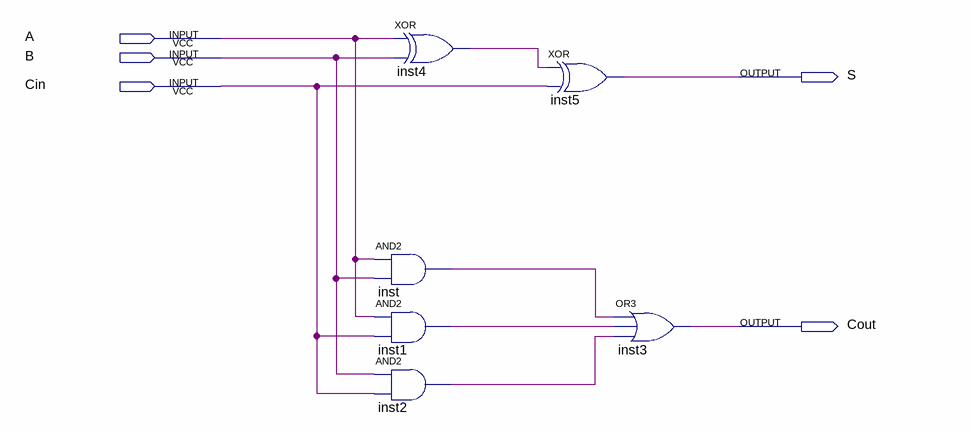
[diagram p0: schematic sheet]
// Quartus schematic FA.bdf as structural Verilog: 6 symbols, 5 pins
module FA (
  input  A,
  input  B,
  input  Cin,
  output S,
  output Cout
);

  wire inst1_out, inst2_out, inst4_out, inst_out;

  xor inst4 (inst4_out, A, B);
  and inst (inst_out, A, B);
  and inst1 (inst1_out, A, Cin);
  and inst2 (inst2_out, B, Cin);
  xor inst5 (S, inst4_out, Cin);
  or inst3 (Cout, inst_out, inst1_out, inst2_out);
endmodule
